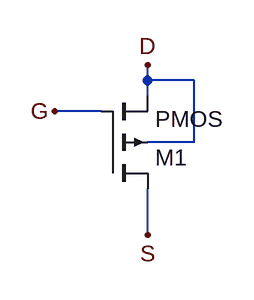
[diagram p0: schematic pmos.asc]
pmos.asc, the LTspice schematic file:
Version 4
SHEET 1 880 680
WIRE -80 -112 -80 -128
WIRE -32 -112 -80 -112
WIRE -80 -96 -80 -112
WIRE -128 -80 -176 -80
WIRE -32 -48 -32 -112
WIRE -32 -48 -80 -48
WIRE -80 48 -80 0
FLAG -176 -80 G
FLAG -80 48 S
FLAG -80 -128 D
SYMBOL pmos4 -128 0 M180
SYMATTR InstName M1

The netlist it stands for:
* pmos.asc
M1 S G D D PMOS
.model NMOS NMOS
.model PMOS PMOS
.lib standard.mos
.backanno
.end